# EAGLE design led_driver (EAGLE 9.6.2)
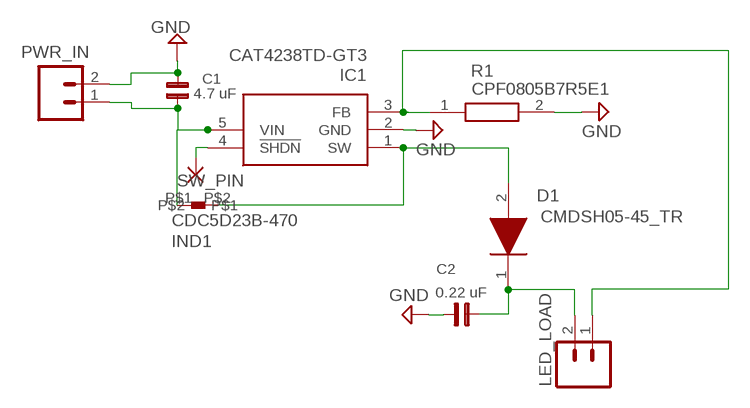
[diagram p0: schematic, sheet 1]

## Parts
C1  4.7 uF  C0805  [0805]
C2  0.22 uF  C0805  [0805]
D1  CMDSH05-45_TR  [SOD2512X110N]
IC1  CAT4238TD-GT3  [SOT95P280X100-5N]
IND1  CDC5D23B-470  [CDC5D23B-470]
LED_LOAD  M02  [02P]
PWR_IN  M02  [02P]
R1  CPF0805B7R5E1  [RESC2012X65N]
SW_PIN  2,54/1,1  [2,54/1,1]

## Nets
GND: C1.2 C2.2 IC1.2(GND) PWR_IN.2 R1.2
N$1: C2.1 D1.1(K) LED_LOAD.2
N$2: IC1.4(!SHDN) SW_PIN.1(P)
N$3: IC1.3(FB) LED_LOAD.1 R1.1
SW: D1.2(A) IC1.1(SW) IND1.P$2
VIN: C1.1 IC1.5(VIN) IND1.P$1 PWR_IN.1

## Library data of the parts
C1 C2 = capsmd:C0805
D1 = SamacSys_Parts:CMDSH05-45_TR: SURFACE MOUNT SILICON LOW VF SCHOTTKY DIODE Source: Datasheet <https://www.centralsemi.com/get_document.php?cmp=1&mergetype=pd&mergepath=pd&pdf_id=CMDSH05-45.PDF>; DESCRIPTION: SURFACE MOUNT SILICON LOW VF SCHOTTKY DIODE; HEIGHT: 1.1mm; MANUFACTURER_NAME: Central Semiconductor; MANUFACTURER_PART_NUMBER: CMDSH05-45 TR; MOUSER_PART_NUMBER: 610-CMDSH05-45TR; MOUSER_PRICE-STOCK: https://www.mouser.com/Search/Refine.aspx?Keyword=610-CMDSH05-45TR
IC1 = SamacSys_Parts:CAT4238TD-GT3: Source: Datasheet <http://www.onsemi.com/pub/Collateral/CAT4238-D.PDF>; ARROW_PART_NUMBER: CAT4238TD-GT3; ARROW_PRICE-STOCK: https://www.arrow.com/en/products/cat4238td-gt3/on-semiconductor; HEIGHT: 1mm; MANUFACTURER_NAME: ON Semiconductor; MANUFACTURER_PART_NUMBER: CAT4238TD-GT3; MOUSER_PART_NUMBER: 698-CAT4238TDG; MOUSER_PRICE-STOCK: https://www.mouser.co.uk/ProductDetail/ON-Semiconductor/CAT4238TD-GT3?qs=9dFQwQorgSxpbLptXYtgxg%3D%3D
IND1 = VincentKeller:CDC5D23B-470: Inductor; DESCRIPTION: Inductor; HEIGHT: 2.5mm; MANUFACTURER_NAME: Sumida; MANUFACTURER_PART_NUMBER: CDC5D23B-470
LED_LOAD PWR_IN = con-amp-quick:M02: AMP QUICK CONNECTOR; OC_FARNELL: unknown; OC_NEWARK: unknown
R1 = SamacSys_Parts:CPF0805B7R5E1: Thin Film Resistors - SMD CPF 0805 7R5 0.1% 25PPM 1K RL Source: Datasheet <http://docs-europe.electrocomponents.com/webdocs/13d1/0900766b813d116f.pdf>; ARROW_PART_NUMBER: CPF0805B7R5E1; ARROW_PRICE-STOCK: https://www.arrow.com/en/products/cpf0805b7r5e1/te-connectivity; DESCRIPTION: Thin Film Resistors - SMD CPF 0805 7R5 0.1% 25PPM 1K RL; HEIGHT: 0.65mm; MANUFACTURER_NAME: TE Connectivity; MANUFACTURER_PART_NUMBER: CPF0805B7R5E1; MOUSER_PART_NUMBER: 279-CPF0805B7R5E1; MOUSER_PRICE-STOCK: https://www.mouser.co.uk/ProductDetail/TE-Connectivity-Holsworthy/CPF0805B7R5E1?qs=HLeXuo0aL2qx7rgngjaMqg%3D%3D
SW_PIN = wirepad:2,54/1,1: THROUGH-HOLE PAD

## Board
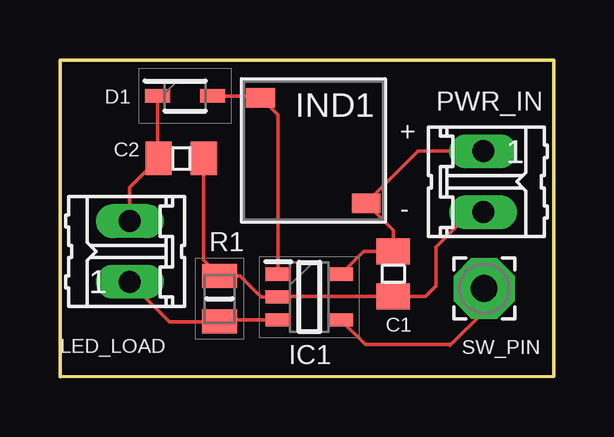
[diagram p1: board, top side]

Size 20.6 x 13.23 mm. Coordinates in mm from the lower left corner, seen from the top.
Outline: 0,13.21 20.6,13.23 20.6,0.02 0,0 0,13.21
Copper layers (1*16): Top 0.035mm / dielectric 1.5mm / Bottom 0.035mm
Design rules "default": minimum track width 6mil, minimum drill 0.35mm, track to track 6mil, track to pad 6mil, pad to pad 6mil, via to via 6mil, smd to smd 6mil, copper to edge 40mil, drill to drill 6mil, minimum pad ring 10mil, minimum via ring 8mil, stop-mask expansion 4mil, vias tented up to drill 0mil, thermal gap 10mil

### Footprints (pad centres in the part's own frame; a part is rotated, then mirrored left to right if it is on the bottom)
0805 = smd 1.092 x 1.397: 1 -0.94,0; 2 0.94,0
SOD2512X110N = smd 1.05 x 0.55: 1 -1.15,0; 2 1.15,0
SOT95P280X100-5N = smd 1.05 x 0.55: 1 -1.3,0.95; 2 -1.3,0; 3 -1.3,-0.95; 4 1.3,-0.95; 5 1.3,0.95
CDC5D23B-470 = smd 1.2 x 0.8: P$1 -2.2,2.2; P$2 2.2,-2.2
02P = drill 0.914 long: 1 -1.27,0; 2 1.27,0
RESC2012X65N = smd 1 x 1.45: 1 -0.95,0; 2 0.95,0
2,54/1,1 = drill 1.118 pad 2.54 octagon: 1 0,0

### Placement (x,y rotation side)
C1  13.9,4.3 270 top
C2  5.06,9.12 0 top
D1  5.22,11.73 0 top
IC1  10.4,3.34 0 top
IND1  10.57,9.45 180 top
LED_LOAD  2.91,5.24 90 top
PWR_IN  17.65,8.15 270 top
R1  6.66,3.27 90 top
SW_PIN  17.69,3.7 0 top

### Tracks (layer width: path | path; a pad name or v marks a point on that pad's centre or on a via)
GND
  Top 0.152: C2.2 6,4.88 R1.2 7.51,4.22 8.39,3.34 IC1.2 | 9.07,3.31 IC1.2 | IC1.2 9.12,3.36 C1.2 15.23,3.36 15.68,3.81 15.68,5.42 17.14,6.88 PWR_IN.2
N$1
  Top 0.152: LED_LOAD.2 2.91,7.91 C2.1 4.07,9.17 D1.1
N$2
  Top 0.152: IC1.4 12.73,1.36 16.24,1.36 16.27,1.33 17.69,2.75 SW_PIN.1
N$3
  Top 0.152: 6.73,2.39 6.93,2.59 | LED_LOAD.1 4.58,2.3 6.64,2.3 R1.1 6.71,2.37 6.73,2.39 | IC1.3 6.73,2.39
SW
  Top 0.152: 8.3,11.65 IND1.P$2 | IND1.P$2 8.29,11.73 D1.2 | IND1.P$2 9.1,10.92 IC1.1
VIN
  Top 0.152: IND1.P$1 12.81,7.21 | 12.81,7.21 13.9,6.12 C1.1 12.65,5.24 IC1.5 | PWR_IN.1 14.93,9.42 12.81,7.3 12.81,7.21

### Text on the board
tNames: + | -